# Altium schematic sheet DashDAP.SchDoc
size 292 x 193 mm; Author: Power Lin; Revision: 0.1; SheetNumber: 1; SheetTotal: 1; Website: wiki-power.com
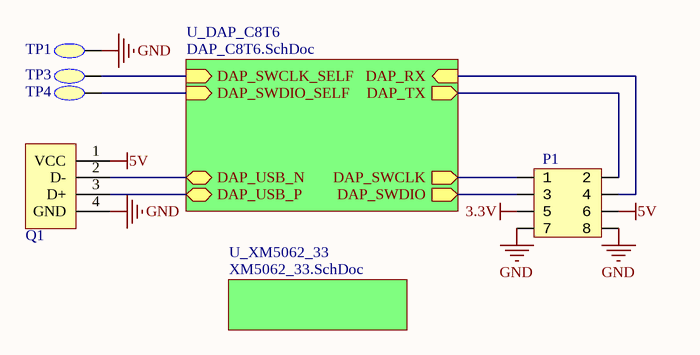
[diagram p0: DashDAP.SchDoc]

## Parts
P1  HDR2x4_2.54  [HDR2X4_2.54_180H]  (value not drawn)
Q1  USB A  [USB-A-male]  (value not drawn)
TP1  TestPoint  [TestPoint]  (value not drawn)
TP3  TestPoint  [TestPoint]  (value not drawn)
TP4  TestPoint  [TestPoint]  (value not drawn)

## Sub-sheets
U_DAP_C8T6 = DAP_C8T6.SchDoc: DAP_SWCLK_SELF (in), DAP_SWDIO_SELF (in), DAP_SWCLK (out), DAP_SWDIO (out), DAP_TX (out), DAP_RX (in), DAP_USB_N (bidir), DAP_USB_P (bidir)
U_XM5062_33 = XM5062_33.SchDoc: no entries

## Nets
3.3V: P1.5
5V: P1.6 Q1.1(VCC)
GND: P1.7 P1.8 Q1.4(GND) TP1.1
NetP1_1: P1.1 ; sheet U_DAP_C8T6/DAP_SWCLK
NetP1_2: P1.2 ; sheet U_DAP_C8T6/DAP_TX
NetP1_3: P1.3 ; sheet U_DAP_C8T6/DAP_SWDIO
NetP1_4: P1.4 ; sheet U_DAP_C8T6/DAP_RX
NetQ1_2: Q1.2(D-) ; sheet U_DAP_C8T6/DAP_USB_N
NetQ1_3: Q1.3(D+) ; sheet U_DAP_C8T6/DAP_USB_P
NetTP3_1: TP3.1 ; sheet U_DAP_C8T6/DAP_SWCLK_SELF
NetTP4_1: TP4.1 ; sheet U_DAP_C8T6/DAP_SWDIO_SELF

## Notes on the sheet
- Author
- DocumentName
- ModifiedDate
- ProjectName
- SheetNumber
- SheetTotal
- Website
- Revision

## Library data of the parts
P1 = HDR2x4_2.54: Header
Q1 = USB A: USB 接口
TP1 TP3 TP4 = TestPoint: 测试点